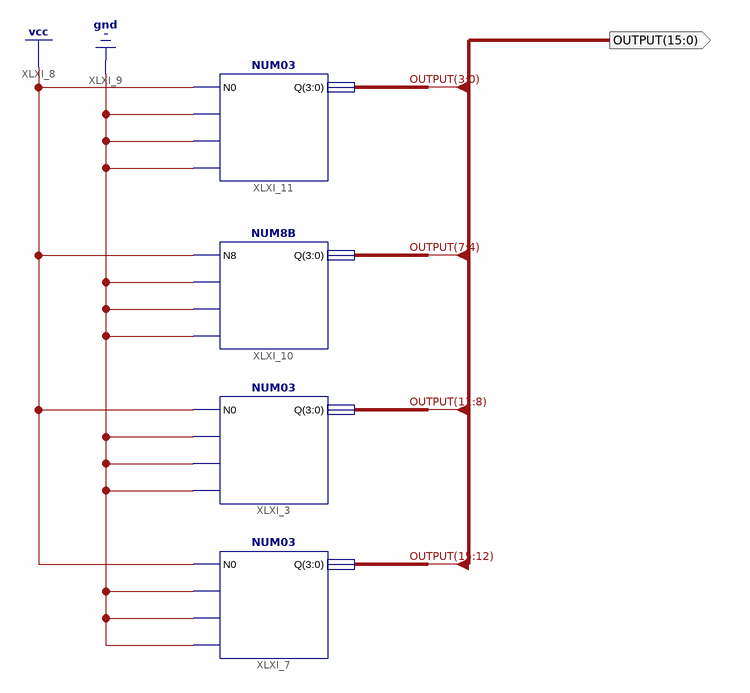
[diagram p0: schematic sheet 1]
// Xilinx ISE schematic BIN_128.sch (spartan6) as structural Verilog: 4 symbols, 1 ports
module BIN_128 (
  output [15:0] OUTPUT
);

  NUM03 XLXI_3 (.N2(1'b0), .N3(1'b0), .N0(1'b1), .N1(1'b0), .Q(OUTPUT[11:8]));
  NUM03 XLXI_7 (.N2(1'b0), .N3(1'b0), .N0(1'b1), .N1(1'b0), .Q(OUTPUT[15:12]));
  NUM8B XLXI_10 (.NA(1'b0), .NB(1'b0), .N8(1'b1), .N9(1'b0), .Q(OUTPUT[7:4]));
  NUM03 XLXI_11 (.N2(1'b0), .N3(1'b0), .N0(1'b1), .N1(1'b0), .Q(OUTPUT[3:0]));
endmodule
